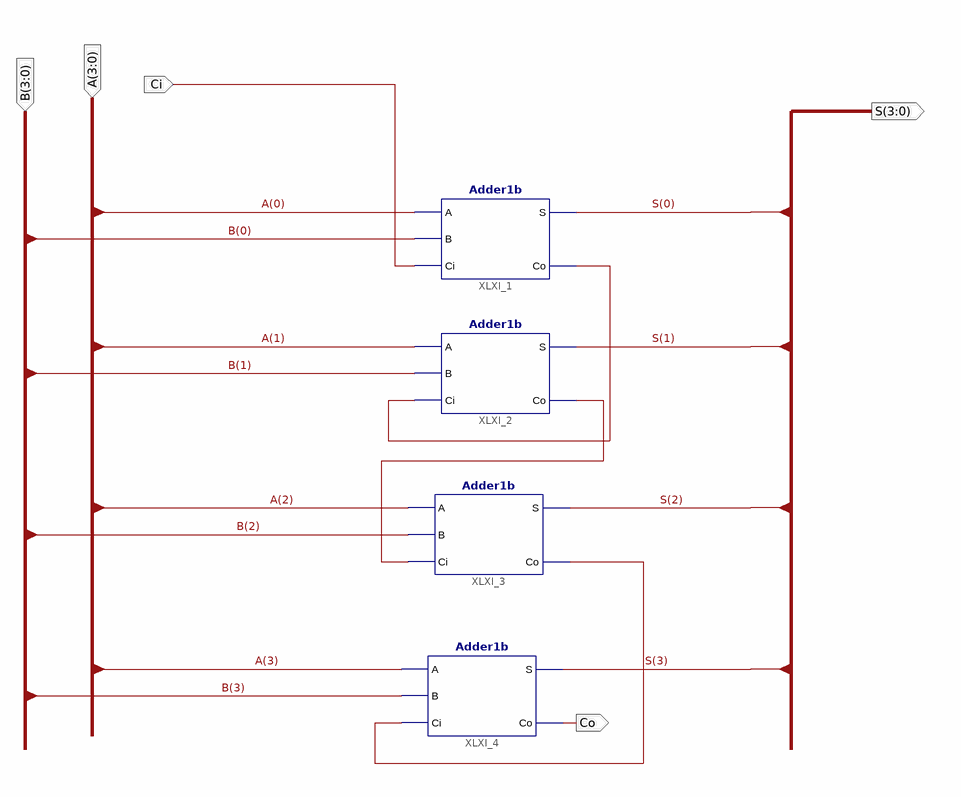
[diagram p0: schematic sheet 1]
// Xilinx ISE schematic Adder4b.sch (kintex7) as structural Verilog: 4 symbols, 5 ports
module Adder4b (
  input  [3:0] A,
  input  [3:0] B,
  input  Ci,
  output Co,
  output [3:0] S
);

  wire XLXN_18, XLXN_19, XLXN_23;

  Adder1b XLXI_1 (.A(A[0]), .B(B[0]), .Ci(Ci), .S(S[0]), .Co(XLXN_18));
  Adder1b XLXI_2 (.A(A[1]), .B(B[1]), .Ci(XLXN_18), .S(S[1]), .Co(XLXN_19));
  Adder1b XLXI_3 (.A(A[2]), .B(B[2]), .Ci(XLXN_19), .S(S[2]), .Co(XLXN_23));
  Adder1b XLXI_4 (.A(A[3]), .B(B[3]), .Ci(XLXN_23), .S(S[3]), .Co(Co));
endmodule
